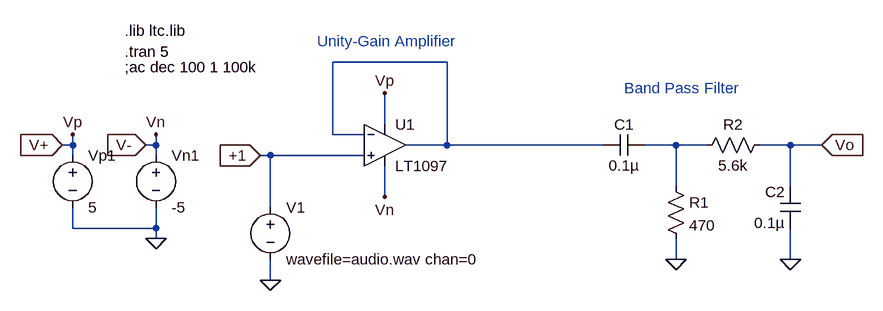
[diagram p0: schematic unit_test.asc]
unit_test.asc, the LTspice schematic file:
Version 4
SHEET 1 1080 680
WIRE 416 -64 240 -64
WIRE 320 32 320 -16
WIRE 240 48 240 -64
WIRE 288 48 240 48
WIRE -160 64 -160 48
WIRE -160 64 -176 64
WIRE -32 64 -32 48
WIRE -32 64 -48 64
WIRE 416 64 416 -64
WIRE 416 64 352 64
WIRE 656 64 416 64
WIRE 768 64 720 64
WIRE 816 64 768 64
WIRE 944 64 896 64
WIRE 992 64 944 64
WIRE -160 80 -160 64
WIRE -32 80 -32 64
WIRE 144 80 128 80
WIRE 288 80 144 80
WIRE 768 128 768 64
WIRE 944 128 944 64
WIRE 320 144 320 96
WIRE 144 160 144 80
WIRE -160 192 -160 160
WIRE -32 192 -32 160
WIRE -32 192 -160 192
WIRE -32 208 -32 192
WIRE 768 240 768 208
WIRE 944 240 944 192
WIRE 144 272 144 240
FLAG 144 272 0
FLAG -32 208 0
FLAG -160 48 Vp
FLAG -32 48 Vn
FLAG 320 144 Vn
FLAG 320 -16 Vp
FLAG 128 80 +1
IOPIN 128 80 In
FLAG -176 64 V+
IOPIN -176 64 In
FLAG -48 64 V-
IOPIN -48 64 In
FLAG 768 240 0
FLAG 944 240 0
FLAG 992 64 Vo
IOPIN 992 64 In
SYMBOL voltage 144 144 R0
WINDOW 123 0 0 Left 0
WINDOW 39 0 0 Left 0
SYMATTR InstName V1
SYMATTR Value wavefile=audio.wav chan=0
SYMBOL voltage -160 64 R0
WINDOW 123 0 0 Left 0
WINDOW 39 0 0 Left 0
SYMATTR InstName Vp1
SYMATTR Value 5
SYMBOL voltage -32 64 R0
WINDOW 123 0 0 Left 0
WINDOW 39 0 0 Left 0
SYMATTR InstName Vn1
SYMATTR Value -5
SYMBOL Opamps\\opamp2 320 0 R0
SYMATTR InstName U1
SYMATTR Value LT1097
SYMBOL cap 720 48 R90
WINDOW 0 0 32 VBottom 2
WINDOW 3 32 32 VTop 2
SYMATTR InstName C1
SYMATTR Value 0.1µ
SYMBOL res 752 112 R0
SYMATTR InstName R1
SYMATTR Value 470
SYMBOL res 800 80 R270
WINDOW 0 32 56 VTop 2
WINDOW 3 0 56 VBottom 2
SYMATTR InstName R2
SYMATTR Value 5.6k
SYMBOL cap 960 192 R180
WINDOW 0 24 56 Left 2
WINDOW 3 24 8 Left 2
SYMATTR InstName C2
SYMATTR Value 0.1µ
TEXT -80 -80 Left 2 !.tran 5
TEXT 216 -96 Left 2 ;Unity-Gain Amplifier
TEXT -80 -112 Left 2 !.lib ltc.lib
TEXT -80 -56 Left 2 !;ac dec 100 1 100k
TEXT 688 -24 Left 2 ;Band Pass Filter

The netlist it stands for:
* unit_test.asc
V1 +1 0 wavefile=audio.wav chan=0
Vp1 V+ 0 5
Vn1 V- 0 -5
XU1 +1 N001 V+ V- N001 LT1097  ; pins In+ In- V+ V- OUT
C1 N002 N001 0.1µ
R1 N002 0 470
R2 N002 Vo 5.6k
C2 0 Vo 0.1µ
.tran 5
* Unity-Gain Amplifier
.lib ltc.lib
;ac dec 100 1 100k
* Band Pass Filter
.backanno
.end